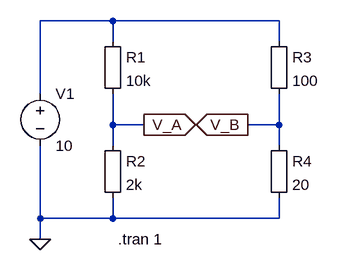
[diagram p0: schematic Brueckenschaltung_1.asc]
Brueckenschaltung_1.asc, the LTspice schematic file:
Version 4
SHEET 1 880 680
WIRE 160 16 48 16
WIRE 416 16 160 16
WIRE 160 48 160 16
WIRE 416 48 416 16
WIRE 48 128 48 16
WIRE 160 176 160 128
WIRE 208 176 160 176
WIRE 416 176 416 128
WIRE 416 176 368 176
WIRE 160 208 160 176
WIRE 416 208 416 176
WIRE 48 320 48 208
WIRE 160 320 160 288
WIRE 160 320 48 320
WIRE 416 320 416 288
WIRE 416 320 160 320
WIRE 48 352 48 320
FLAG 208 176 V_A
IOPIN 208 176 Out
FLAG 368 176 V_B
IOPIN 368 176 Out
FLAG 48 352 0
SYMBOL Misc\\EuropeanResistor 144 32 R0
SYMATTR InstName R1
SYMATTR Value 10k
SYMBOL Misc\\EuropeanResistor 144 192 R0
SYMATTR InstName R2
SYMATTR Value 2k
SYMBOL Misc\\EuropeanResistor 400 32 R0
SYMATTR InstName R3
SYMATTR Value 100
SYMBOL Misc\\EuropeanResistor 400 192 R0
SYMATTR InstName R4
SYMATTR Value 20
SYMBOL voltage 48 112 R0
WINDOW 123 0 0 Left 0
WINDOW 39 0 0 Left 0
SYMATTR InstName V1
SYMATTR Value 10
TEXT 168 352 Left 2 !.tran 1

The netlist it stands for:
* Brueckenschaltung_1.asc
R1 N001 V_A 10k
R2 V_A 0 2k
R3 N001 V_B 100
R4 V_B 0 20
V1 N001 0 10
.tran 1
.backanno
.end